# Altium schematic sheet Mag_Ang.SchDoc
size A4
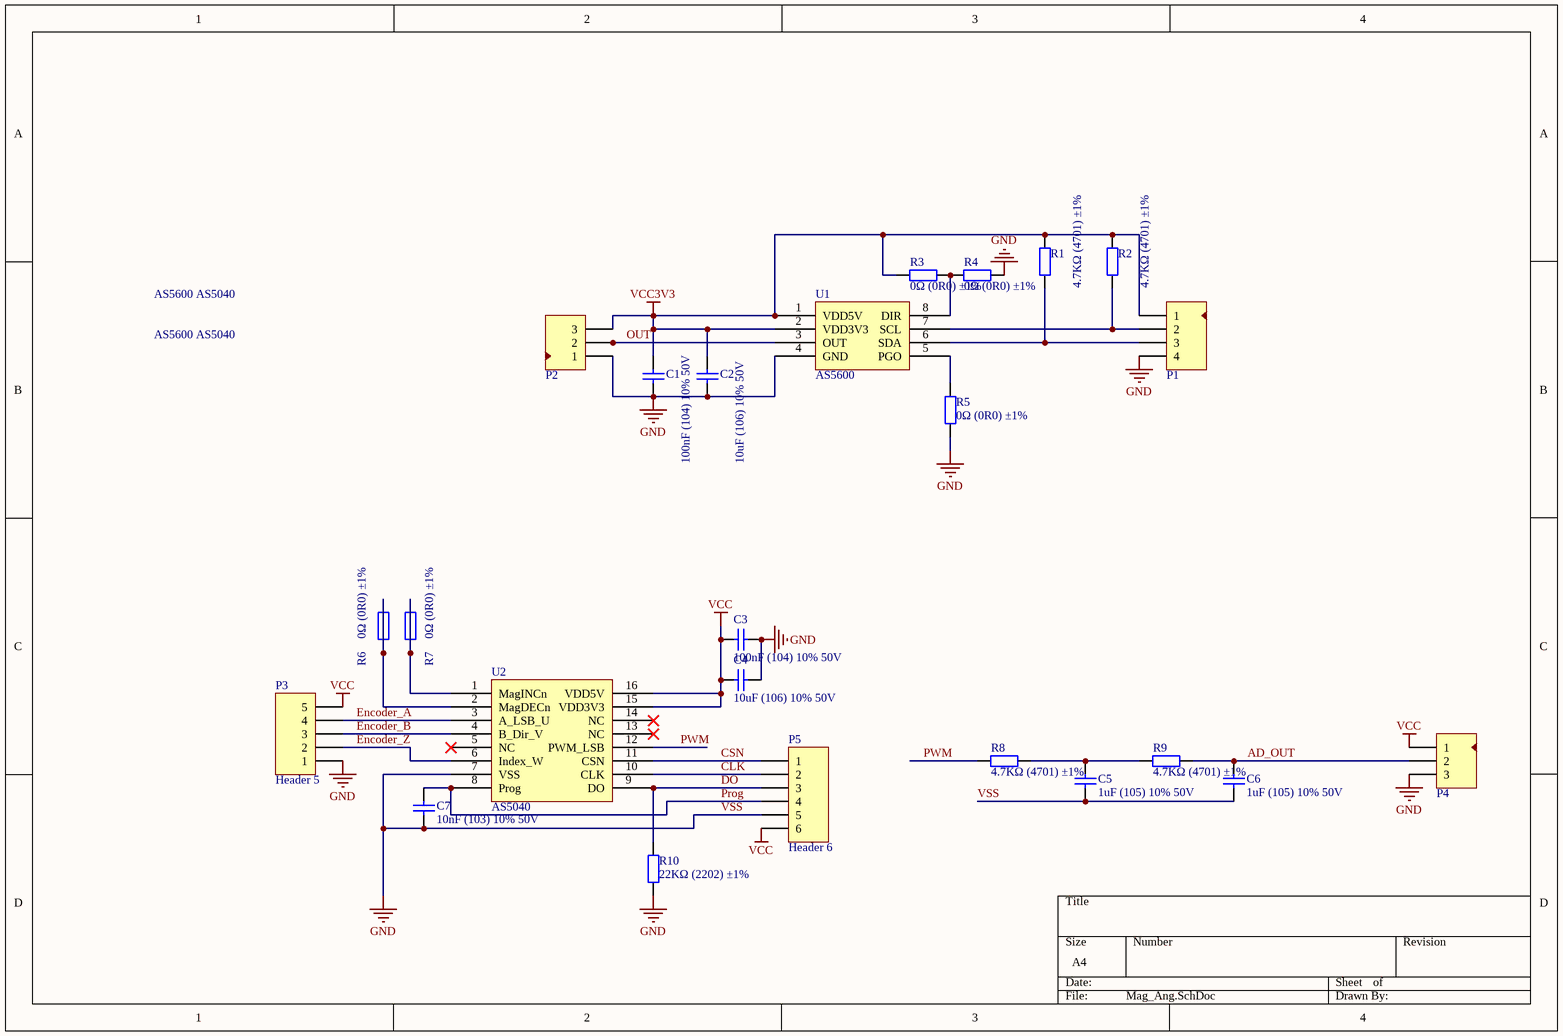
[diagram p0: Mag_Ang.SchDoc]

## Parts
C1  100nF (104) 10% 50V  [0603_C]
C2  10uF (106) 10% 50V  [1206_C]
C3  100nF (104) 10% 50V  [0603_C]
C4  10uF (106) 10% 50V  [1206_C]
C5  1uF (105) 10% 50V  [0603_C]
C6  1uF (105) 10% 50V  [0603_C]
C7  10nF (103) 10% 50V  [0603_C]
P1  Header 4  [XH2.54-4P]  (value not drawn)
P2  Header 3  [KF2.54-3P]  (value not drawn)
P3  Header 5  [HDR1X5]
P4  Header 3  [KF2.54-3P]  (value not drawn)
P5  Header 6  [HDR1X6]
R1  4.7KΩ (4701) ±1%  [0603_R]
R2  4.7KΩ (4701) ±1%  [0603_R]
R3  0Ω (0R0) ±1%  [0603_R]
R4  0Ω (0R0) ±1%  [0603_R]
R5  0Ω (0R0) ±1%  [0603_R]
R6  0Ω (0R0) ±1%  [0603_R]
R7  0Ω (0R0) ±1%  [0603_R]
R8  4.7KΩ (4701) ±1%  [0603_R]
R9  4.7KΩ (4701) ±1%  [0603_R]
R10  22KΩ (2202) ±1%  [0603_R]
U1  AS5600  [RS2101S]
U2  AS5040  [SOP65P780X180-16N]

## Nets
VCC: C3.1 C4.2 P3.5 P4.1 P5.6 U2.15(VDD3V3) U2.16(VDD5V)
VCC3V3: C1.2 C2.2 P1.1 P2.3 R1.2 R2.2 R3.2 U1.1(VDD5V) U1.2(VDD3V3)
VSS: C1.1 C2.1 C3.2 C4.1 C5.1 C6.1 C7.1 P1.4 P2.1 P3.1 P4.3 P5.5 R4.1 R5.2 R10.1 U1.4(GND) U2.7(VSS)  [also labelled GND]
AD_OUT: C6.2 P4.2 R9.2
CLK: P5.2 U2.10(CLK)
CSN: P5.1 U2.11(CSN)
DO: P5.3 R10.2 U2.9(DO)
Encoder_A: P3.4 U2.3(A_LSB_U)
Encoder_B: P3.3 U2.4(B_Dir_V)
Encoder_Z: P3.2 U2.6(Index_W)
OUT: P2.2 U1.3(OUT)
Prog: C7.2 P5.4 U2.8(Prog)
PWM: R8.1 U2.12(PWM_LSB)
NetC5_2: C5.2 R8.2 R9.1
NetP1_2: P1.2 R2.1 U1.7(SCL)
NetP1_3: P1.3 R1.1 U1.6(SDA)
NetR3_1: R3.1 R4.2 U1.8(DIR)
NetR5_1: R5.1 U1.5(PGO)
NetR6_1: R6.1 R6.2 U2.2(MagDECn)
NetR7_1: R7.1 R7.2 U2.1(MagINCn)

Not connected (* = marked no-connect by the designer): U2 5(NC)* 13(NC)* 14(NC)*

## Notes on the sheet
- AS5600 AS5040

## Library data of the parts
C1 C3 = 0603 100nF (104) 10% 50V: 贴片电容; ComponentLink1Description: 供应商链接; ComponentLink1URL: http://www.szlcsc.com/product/details_15331.html; Package: 0603; Supplier: LC; SuppliersPartNumber: C14663
C2 C4 = 1206 10uF (106) 10% 50V: 贴片电容; ComponentLink1Description: 供应商链接; ComponentLink1URL: http://www.szlcsc.com/product/details_14236.html; Package: 1206; Supplier: LC; SuppliersPartNumber: C13585
C5 C6 = 0603 1uF (105) 10% 50V: 贴片电容; ComponentLink1Description: 供应商链接; ComponentLink1URL: http://www.szlcsc.com/product/details_16531.html; Package: 0603; Supplier: LC; SuppliersPartNumber: C15849
C7 = 0603 10nF (103) 10% 50V: 贴片电容; ComponentLink1Description: 供应商链接; ComponentLink1URL: http://www.szlcsc.com/product/details_58143.html; Package: 0603; Supplier: LC; SuppliersPartNumber: C57112
P1 = Header 4: 接插件; LatestRevisionDate: 17-Jul-2002; LatestRevisionNote: Re-released for DXP Platform.; Publisher: Altium Limited
P2 P4 = Header 3: 接插件; LatestRevisionDate: 17-Jul-2002; LatestRevisionNote: Re-released for DXP Platform.; Publisher: Altium Limited
P3 = Header 5: Header, 5-Pin; LatestRevisionDate: 17-Jul-2002; LatestRevisionNote: Re-released for DXP Platform.; Publisher: Altium Limited
P5 = Header 6: Header, 6-Pin; LatestRevisionDate: 17-Jul-2002; LatestRevisionNote: Re-released for DXP Platform.; Publisher: Altium Limited
R1 R2 R8 R9 = 0603 4.7KΩ (4701) 1%: 贴片电阻; ComponentLink1Description: 供应商链接; ComponentLink1URL: http://www.szlcsc.com/product/details_23889.html; Package: 0603; Supplier: LC; SuppliersPartNumber: C23162
R3-R7 = 0603 0Ω (0R0) 1%: 贴片电阻; ComponentLink1Description: 供应商链接; ComponentLink1URL: http://www.szlcsc.com/product/details_21903.html; Package: 0603; Supplier: LC; SuppliersPartNumber: C21189
R10 = 0603 22KΩ (2202) 1%: 贴片电阻; ComponentLink1Description: 供应商链接; ComponentLink1URL: http://www.szlcsc.com/product/details_32812.html; Package: 0603; Supplier: LC; SuppliersPartNumber: C31850